# EAGLE design 75x35 2P-BOB (EAGLE 9.6.2)
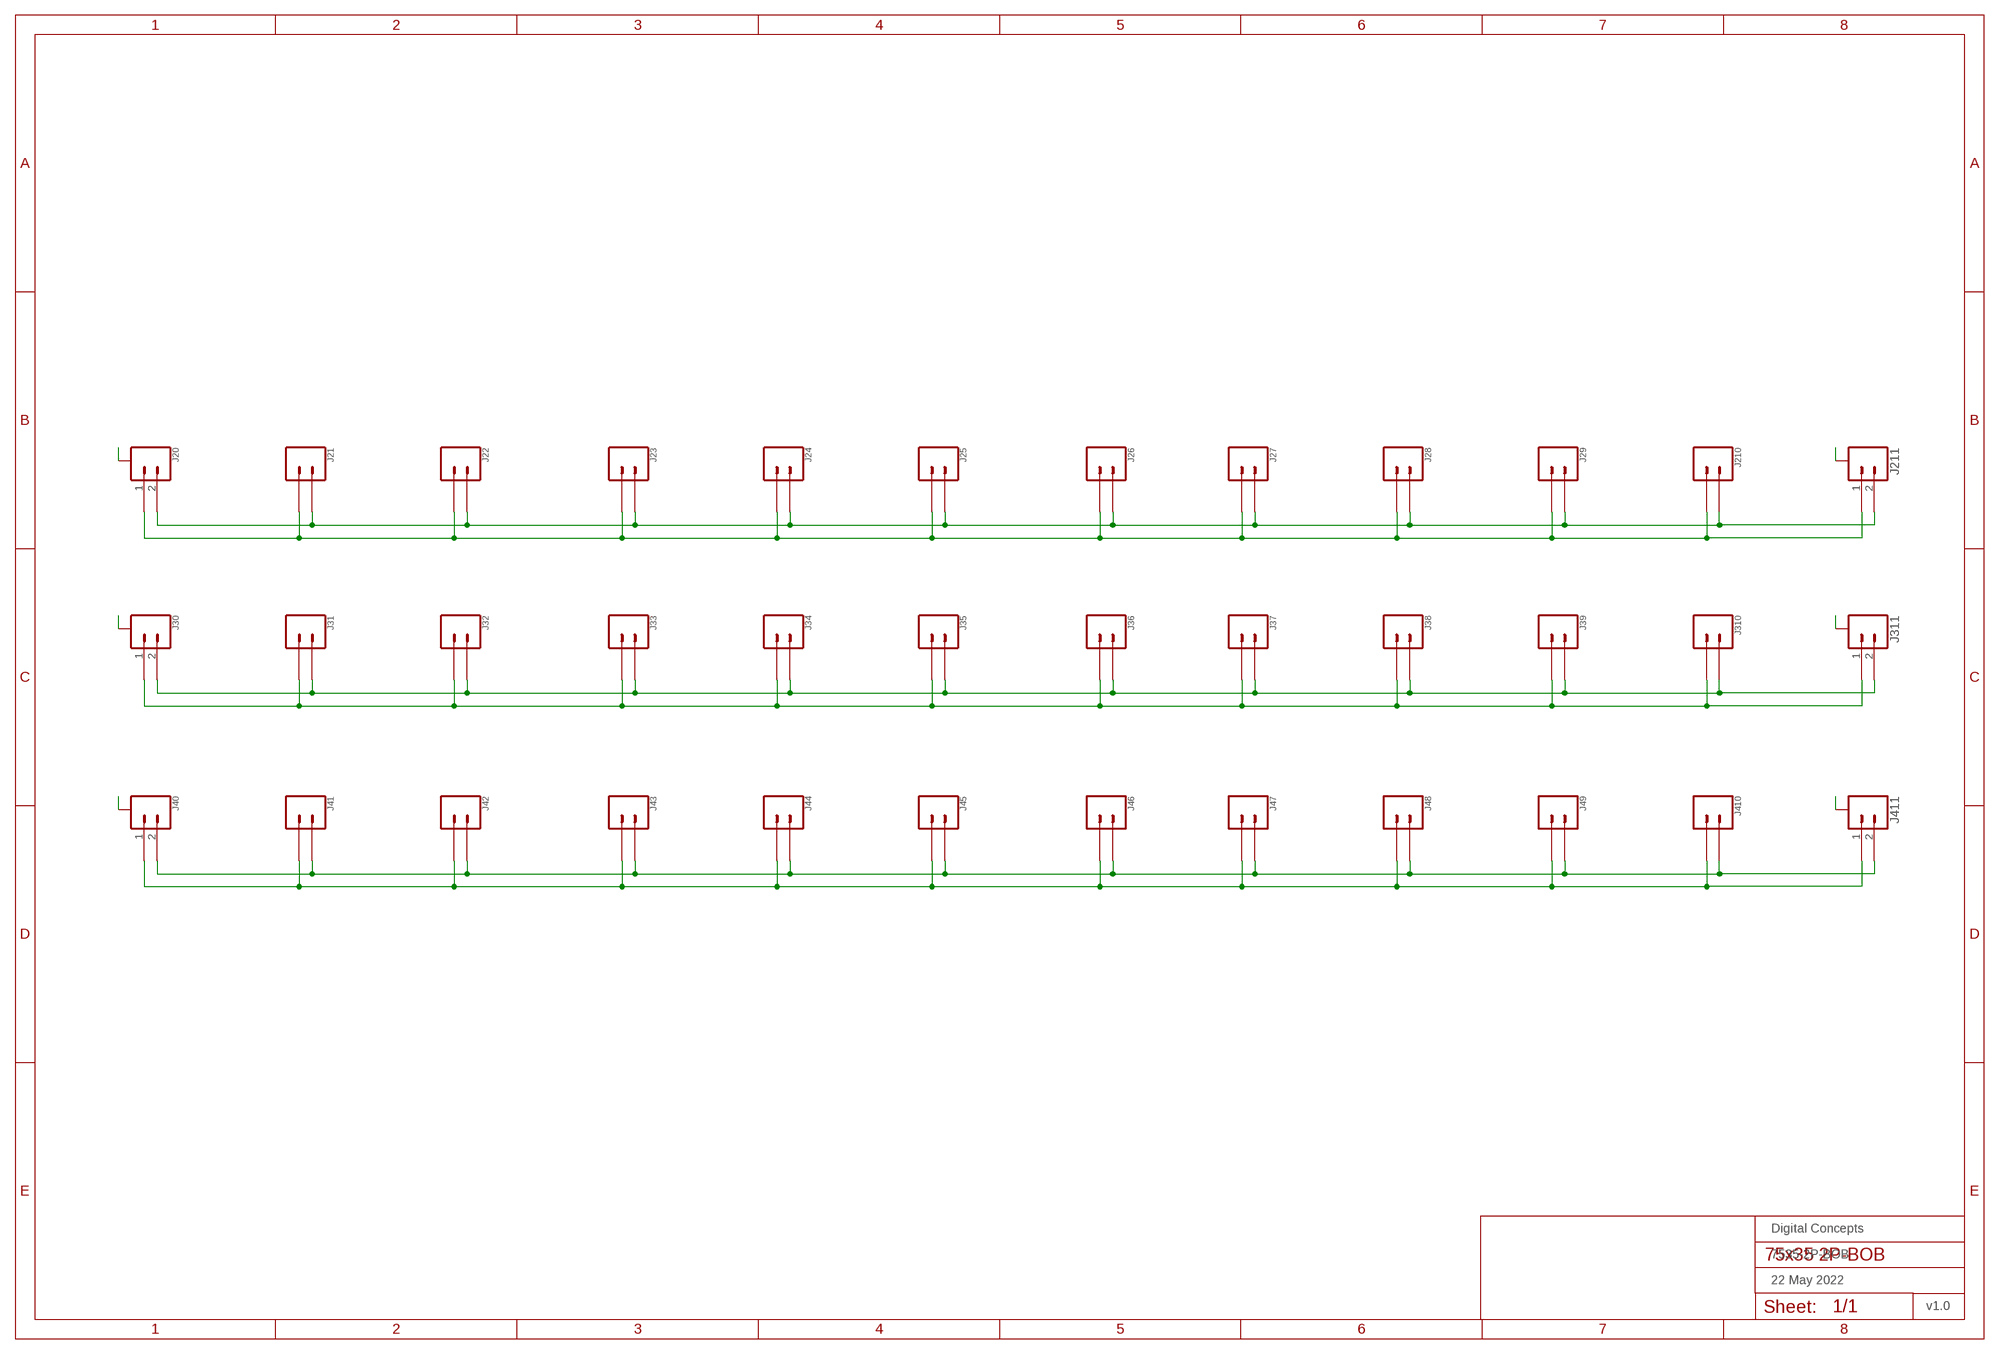
[diagram p0: schematic, sheet 1]
FRAME1 (FRAME-A3L-LOC): DATE: 22 May 2022; OWNER: Digital Concepts; TITLE: 7535-2P-BOB; VERSION: v1.0

## Parts
J20  JST-SH1.0-2-SMD-VERTICAL  [JST-SH1.0-2-VERTICAL]
J21  JST-GH1.25-2-VERTICAL  [JST-GH1.25-2-VERTICAL]
J22  JST-PH2.0-2-VERTICAL  [JST-PH2.0-2-VERTICAL]
J23  HEADER-1X2-GENERIC  [CONN_02-GENERIC]
J24  HEADER-1X2-GENERIC  [CONN_02-GENERIC]
J25  HEADER-1X2-GENERIC  [CONN_02-GENERIC]
J26  HEADER-1X2-GENERIC  [CONN_02-GENERIC]
J27  HEADER-1X2-GENERIC  [CONN_02-GENERIC]
J28  HEADER-1X2-GENERIC  [CONN_02-GENERIC]
J29  JST-PH2.0-2-VERTICAL  [JST-PH2.0-2-VERTICAL]
J30  JST-SH1.0-2-SMD-VERTICAL  [JST-SH1.0-2-VERTICAL]
J31  JST-GH1.25-2-VERTICAL  [JST-GH1.25-2-VERTICAL]
J32  JST-PH2.0-2-VERTICAL  [JST-PH2.0-2-VERTICAL]
J33  HEADER-1X2-GENERIC  [CONN_02-GENERIC]
J34  HEADER-1X2-GENERIC  [CONN_02-GENERIC]
J35  HEADER-1X2-GENERIC  [CONN_02-GENERIC]
J36  HEADER-1X2-GENERIC  [CONN_02-GENERIC]
J37  HEADER-1X2-GENERIC  [CONN_02-GENERIC]
J38  HEADER-1X2-GENERIC  [CONN_02-GENERIC]
J39  JST-PH2.0-2-VERTICAL  [JST-PH2.0-2-VERTICAL]
J40  JST-SH1.0-2-SMD-VERTICAL  [JST-SH1.0-2-VERTICAL]
J41  JST-GH1.25-2-VERTICAL  [JST-GH1.25-2-VERTICAL]
J42  JST-PH2.0-2-VERTICAL  [JST-PH2.0-2-VERTICAL]
J43  HEADER-1X2-GENERIC  [CONN_02-GENERIC]
J44  HEADER-1X2-GENERIC  [CONN_02-GENERIC]
J45  HEADER-1X2-GENERIC  [CONN_02-GENERIC]
J46  HEADER-1X2-GENERIC  [CONN_02-GENERIC]
J47  HEADER-1X2-GENERIC  [CONN_02-GENERIC]
J48  HEADER-1X2-GENERIC  [CONN_02-GENERIC]
J49  JST-PH2.0-2-VERTICAL  [JST-PH2.0-2-VERTICAL]
J210  JST-GH1.25-2-VERTICAL  [JST-GH1.25-2-VERTICAL]
J211  JST-SH1.0-2-SMD-VERTICAL  [JST-SH1.0-2-VERTICAL]
J310  JST-GH1.25-2-VERTICAL  [JST-GH1.25-2-VERTICAL]
J311  JST-SH1.0-2-SMD-VERTICAL  [JST-SH1.0-2-VERTICAL]
J410  JST-GH1.25-2-VERTICAL  [JST-GH1.25-2-VERTICAL]
J411  JST-SH1.0-2-SMD-VERTICAL  [JST-SH1.0-2-VERTICAL]

## Nets
A: J20.A@1(A) J20.A@2(A) J30.A@1(A) J30.A@2(A) J40.A@1(A) J40.A@2(A) J211.A@1(A) J211.A@2(A) J311.A@1(A) J311.A@2(A) J411.A@1(A) J411.A@2(A)
N$1: J20.1 J21.1 J22.1 J23.1 J24.1 J25.1 J26.1 J27.1 J28.1 J29.1 J210.1 J211.1
N$2: J30.2 J31.2 J32.2 J33.2 J34.2 J35.2 J36.2 J37.2 J38.2 J39.2 J310.2 J311.2
N$3: J30.1 J31.1 J32.1 J33.1 J34.1 J35.1 J36.1 J37.1 J38.1 J39.1 J310.1 J311.1
N$4: J40.2 J41.2 J42.2 J43.2 J44.2 J45.2 J46.2 J47.2 J48.2 J49.2 J410.2 J411.2
N$5: J40.1 J41.1 J42.1 J43.1 J44.1 J45.1 J46.1 J47.1 J48.1 J49.1 J410.1 J411.1
N$7: J20.2 J21.2 J22.2 J23.2 J24.2 J25.2 J26.2 J27.2 J28.2 J29.2 J210.2 J211.2

## Library data of the parts
J20 J30 J40 J211 J311 J411 = digitalconcepts:JST-SH1.0-2-SMD-VERTICAL: JST SH1.0 2P SMD Vertical Connector
J21 J31 J41 J210 J310 J410 = digitalconcepts:JST-GH1.25-2-VERTICAL: JST GH1.25 2P PTH Connector
J22 J29 J32 J39 J42 J49 = digitalconcepts:JST-PH2.0-2-VERTICAL: PH2.0 2P Vertical Connector
J23-J28 J33-J38 J43-J48 = digitalconcepts:HEADER-1X2-GENERIC: Single Row 2-Pin Header

## Board
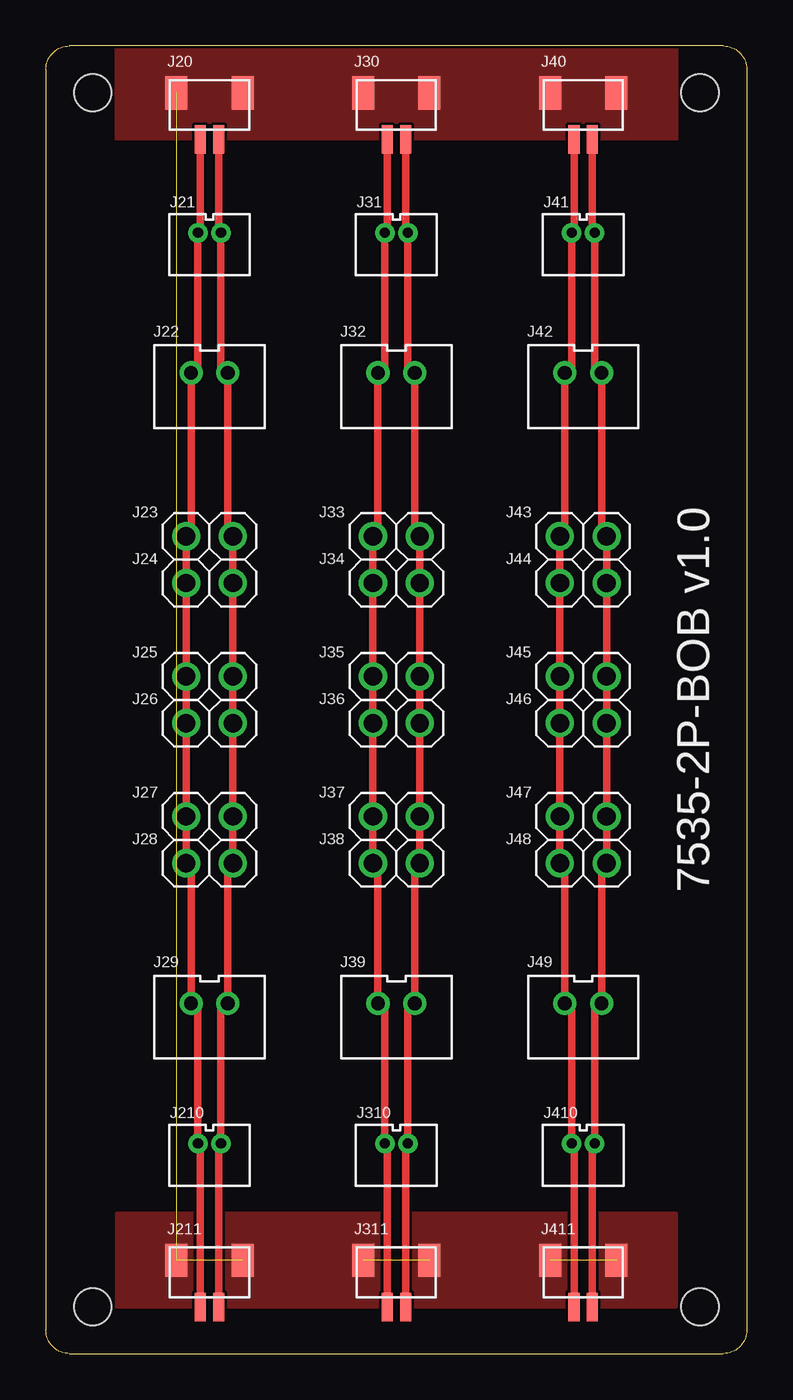
[diagram p1: board, top side]
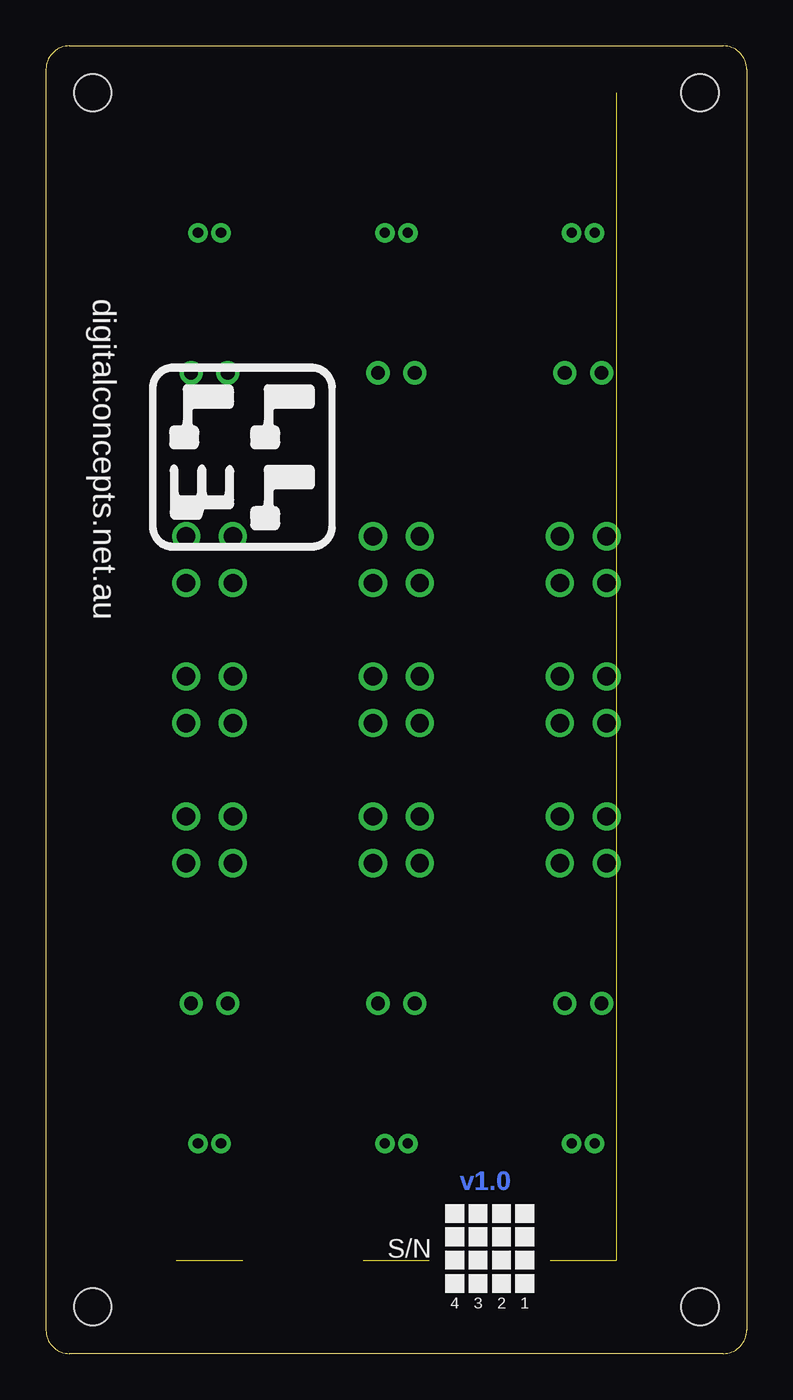
[diagram p2: board, bottom side, seen from below]

Size 38.1 x 71.12 mm. Coordinates in mm from the lower left corner, seen from the top.
Outline: 36.83,71.12 arc-90 38.1,69.85 38.1,1.27 arc-90 36.83,0 1.27,0 arc-90 0,1.27 0,69.85 arc-90 1.27,71.12 36.83,71.12
Copper layers (1*16): Top 0.035mm / dielectric 1.5mm / Bottom 0.035mm
Design rules "default *": minimum track width 6mil, minimum drill 0.35mm, track to track 6mil, track to pad 6mil, pad to pad 6mil, via to via 6mil, smd to smd 6mil, copper to edge 6mil, drill to drill 6mil, minimum pad ring 10mil, minimum via ring 8mil, stop-mask expansion 4mil, vias tented up to drill 0mil, thermal gap 0mil
Holes 2.03 mm at 2.54,68.58 2.54,2.54 35.56,2.54 35.56,68.58

### Footprints (pad centres in the part's own frame; a part is rotated, then mirrored left to right if it is on the bottom)
JST-SH1.0-2-VERTICAL = smd 0.6 x 1.55: 1 -0.5,-2.54; 2 0.5,-2.54 | smd 1.2 x 1.8: A@1 -1.8,-0.015; A@2 1.8,-0.015
JST-GH1.25-2-VERTICAL = drill 0.55 pad 1.016: 1 -0.625,0; 2 0.625,0
JST-PH2.0-2-VERTICAL = drill 0.75: 1 -1,0; 2 1,0
CONN_02-GENERIC = drill 1 pad 1.524: 1 0,0; 2 2.54,0

### Placement (x,y rotation side)
J20  8.89,68.58 0 top
J21  8.89,60.96 0 top
J22  8.89,53.34 0 top
J23  7.62,44.45 0 top
J24  7.62,41.91 0 top
J25  7.62,36.83 0 top
J26  7.62,34.29 0 top
J27  7.62,29.21 0 top
J28  7.62,26.67 0 top
J29  8.89,19.05 0 top
J30  19.05,68.58 0 top
J31  19.05,60.96 0 top
J32  19.05,53.34 0 top
J33  17.78,44.45 0 top
J34  17.78,41.91 0 top
J35  17.78,36.83 0 top
J36  17.78,34.29 0 top
J37  17.78,29.21 0 top
J38  17.78,26.67 0 top
J39  19.05,19.05 0 top
J40  29.21,68.58 0 top
J41  29.21,60.96 0 top
J42  29.21,53.34 0 top
J43  27.94,44.45 0 top
J44  27.94,41.91 0 top
J45  27.94,36.83 0 top
J46  27.94,34.29 0 top
J47  27.94,29.21 0 top
J48  27.94,26.67 0 top
J49  29.21,19.05 0 top
J210  8.89,11.43 0 top
J211  8.89,5.08 0 top
J310  19.05,11.43 0 top
J311  19.05,5.08 0 top
J410  29.21,11.43 0 top
J411  29.21,5.08 0 top

### Tracks (layer width: path | path; a pad name or v marks a point on that pad's centre or on a via)
A  (4 unrouted)
  pour Top: 3.81,71.12 34.29,71.12 34.29,66.04 3.81,66.04
  pour Top: 3.81,2.54 34.29,2.54 34.29,7.62 3.81,7.62
N$1
  Top 0.406: J20.1 8.39,61.09 J21.1 8.27,53.72 J22.1 7.89,44.72 J23.1 J24.1 J25.1 J26.1 J27.1 J28.1 7.89,26.4 J29.1 8.27,18.68 J210.1 8.39,11.3 J211.1
N$2
  Top 0.406: J30.2 19.55,61.09 J31.2 19.68,53.72 J32.2 20.05,44.72 J33.2 J34.2 J35.2 J36.2 J37.2 J38.2 20.05,26.4 J39.2 19.68,18.68 J310.2 19.55,11.3 J311.2
N$3
  Top 0.406: J30.1 18.55,61.09 J31.1 18.43,53.72 J32.1 18.05,44.72 J33.1 J34.1 J35.1 J36.1 J37.1 J38.1 18.05,26.4 J39.1 18.43,18.68 J310.1 18.55,11.3 J311.1
N$4
  Top 0.406: J40.2 29.71,61.09 J41.2 29.84,53.72 J42.2 30.21,44.72 J43.2 J44.2 J45.2 J46.2 J47.2 J48.2 30.21,26.4 J49.2 29.84,18.68 J410.2 29.71,11.3 J411.2
N$5
  Top 0.406: J40.1 28.71,61.09 J41.1 28.59,53.72 J42.1 28.21,44.72 J43.1 J44.1 J45.1 J46.1 J47.1 J48.1 28.21,26.4 J49.1 28.59,18.68 J410.1 28.71,11.3 J411.1
N$7
  Top 0.406: J20.2 9.39,61.09 J21.2 9.52,53.72 J22.2 9.89,44.72 J23.2 J24.2 J25.2 J26.2 J27.2 J28.2 9.89,26.4 J29.2 9.52,18.68 J210.2 9.39,11.3 J211.2

### Text on the board
Bottom: v1.0
tPlace: 7535-2P-BOB v1.0
bPlace: digitalconcepts.net.au | S/N | 1 | 2 | 3 | 4